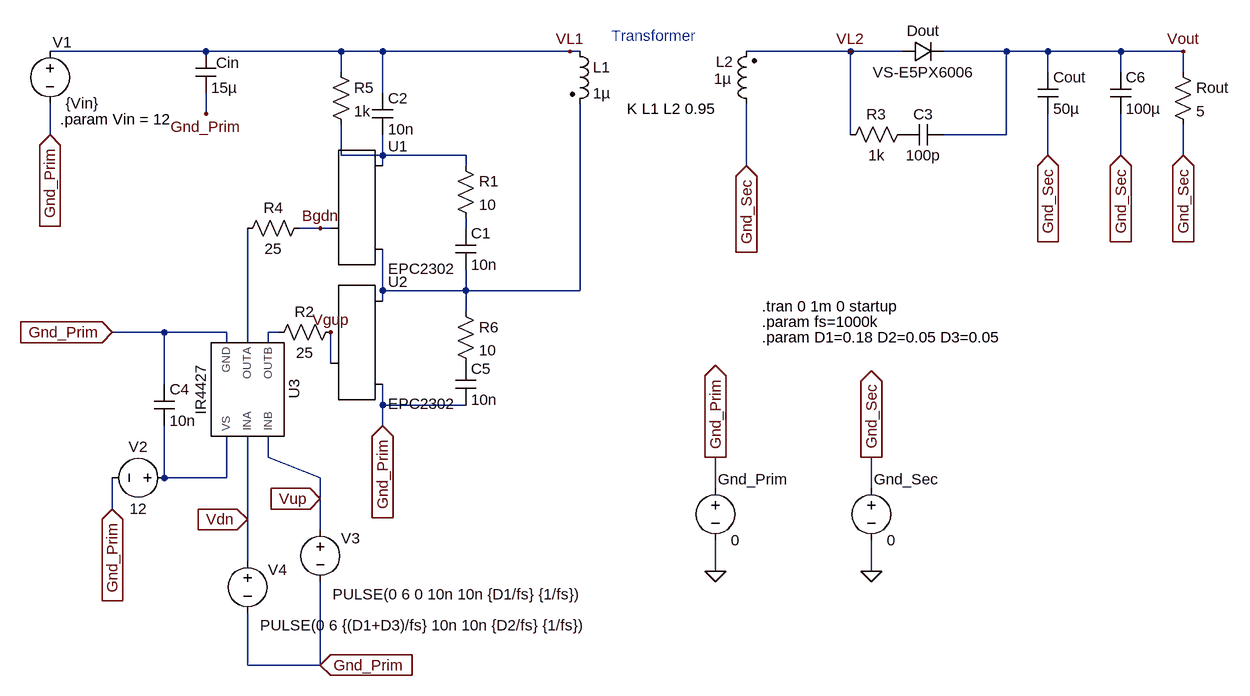
[diagram p0: schematic Flyback V6.asc]
Flyback V6.asc, the LTspice schematic file:
Version 4
SHEET 1 1088 816
WIRE -496 -288 -736 -288
WIRE -288 -288 -496 -288
WIRE -224 -288 -288 -288
WIRE 64 -288 -224 -288
WIRE 80 -288 64 -288
WIRE 496 -288 336 -288
WIRE 576 -288 496 -288
WIRE 736 -288 640 -288
WIRE 800 -288 736 -288
WIRE 912 -288 800 -288
WIRE 1008 -288 912 -288
WIRE -288 -256 -288 -288
WIRE 800 -256 800 -288
WIRE 912 -256 912 -288
WIRE 1008 -256 1008 -288
WIRE -224 -224 -224 -288
WIRE -496 -192 -496 -224
WIRE -736 -160 -736 -208
WIRE 496 -160 496 -288
WIRE 736 -160 736 -288
WIRE 736 -160 640 -160
WIRE -288 -128 -288 -176
WIRE -224 -128 -224 -160
WIRE -224 -128 -288 -128
WIRE -96 -128 -224 -128
WIRE 800 -128 800 -192
WIRE 912 -128 912 -192
WIRE 1008 -128 1008 -176
WIRE -224 -112 -224 -128
WIRE -96 -112 -96 -128
WIRE 336 -112 336 -208
WIRE -320 -16 -352 -16
WIRE -304 -16 -320 -16
WIRE -96 -16 -96 -32
WIRE -224 80 -224 16
WIRE -96 80 -96 48
WIRE -96 80 -224 80
WIRE 80 80 80 -208
WIRE 80 80 -96 80
WIRE -224 96 -224 80
WIRE -96 112 -96 80
WIRE -560 144 -640 144
WIRE -464 144 -560 144
WIRE -384 144 -400 144
WIRE -464 160 -464 144
WIRE -432 160 -432 -16
WIRE -400 160 -400 144
WIRE -304 192 -304 144
WIRE -560 224 -560 144
WIRE -224 256 -224 224
WIRE -96 256 -224 256
WIRE -224 288 -224 256
WIRE -400 336 -400 304
WIRE -560 368 -560 288
WIRE -464 368 -464 304
WIRE -464 368 -560 368
WIRE -320 368 -400 336
WIRE 288 384 288 336
WIRE 528 384 528 336
WIRE -320 400 -320 368
WIRE -640 416 -640 368
WIRE -432 432 -432 304
WIRE -320 448 -320 400
WIRE -432 496 -432 432
WIRE 288 512 288 464
WIRE 528 512 528 464
WIRE -432 656 -432 576
WIRE -320 656 -320 528
WIRE -320 656 -432 656
FLAG 1008 -288 Vout
FLAG 64 -288 VL1
FLAG 496 -288 VL2
FLAG -432 432 Vdn
IOPIN -432 432 In
FLAG -320 400 Vup
IOPIN -320 400 In
FLAG -304 144 Vgup
FLAG -320 -16 Bgdn
FLAG 288 512 0
FLAG 288 336 Gnd_Prim
IOPIN 288 336 Out
FLAG 528 512 0
FLAG 528 336 Gnd_Sec
IOPIN 528 336 Out
FLAG -224 288 Gnd_Prim
IOPIN -224 288 In
FLAG -320 656 Gnd_Prim
IOPIN -320 656 In
FLAG -640 416 Gnd_Prim
IOPIN -640 416 In
FLAG -736 -160 Gnd_Prim
IOPIN -736 -160 In
FLAG -496 -192 Gnd_Prim
FLAG 336 -112 Gnd_Sec
IOPIN 336 -112 In
FLAG 800 -128 Gnd_Sec
IOPIN 800 -128 In
FLAG 912 -128 Gnd_Sec
IOPIN 912 -128 In
FLAG 1008 -128 Gnd_Sec
IOPIN 1008 -128 In
FLAG -640 144 Gnd_Prim
IOPIN -640 144 In
SYMBOL ind2 64 -304 R0
SYMATTR InstName L1
SYMATTR Value 1µ
SYMBOL ind2 352 -192 R180
WINDOW 0 36 80 Left 2
WINDOW 3 39 54 Left 2
SYMATTR InstName L2
SYMATTR Value 1µ
SYMBOL voltage -736 -304 R0
WINDOW 123 0 0 Left 0
WINDOW 39 24 44 Left 2
WINDOW 0 4 2 Left 2
SYMATTR InstName V1
SYMATTR Value {Vin}
SYMBOL diode 576 -272 R270
WINDOW 0 32 32 VTop 2
WINDOW 3 0 32 VBottom 2
SYMATTR InstName Dout
SYMATTR Value VS-E5PX6006
SYMBOL res 992 -272 R0
SYMATTR InstName Rout
SYMATTR Value 5
SYMBOL voltage -544 368 R90
WINDOW 0 -32 56 VBottom 2
WINDOW 3 32 56 VTop 2
WINDOW 123 0 0 Left 0
WINDOW 39 0 0 Left 0
SYMATTR InstName V2
SYMATTR Value 12
SYMBOL voltage -320 432 R0
WINDOW 123 0 0 Left 0
WINDOW 39 0 0 Left 0
WINDOW 3 19 115 Left 2
WINDOW 0 32 29 Left 2
SYMATTR Value PULSE(0 6 0 10n 10n {D1/fs} {1/fs})
SYMATTR InstName V3
SYMBOL IR4427 -432 224 R90
SYMATTR InstName U3
SYMBOL cap 784 -256 R0
SYMATTR InstName Cout
SYMATTR Value 50µ
SYMBOL cap -512 -288 R0
WINDOW 0 32 17 Left 2
SYMATTR InstName Cin
SYMATTR Value 15µ
SYMBOL EPCGaN -304 192 R0
SYMATTR InstName U2
SYMATTR Value EPC2302
SYMBOL res -112 -128 R0
SYMATTR InstName R1
SYMATTR Value 10
SYMBOL cap -112 -16 R0
SYMATTR InstName C1
SYMATTR Value 10n
SYMBOL res 592 -176 R90
WINDOW 0 0 56 VBottom 2
WINDOW 3 32 56 VTop 2
SYMATTR InstName R3
SYMATTR Value 1k
SYMBOL cap 640 -176 R90
WINDOW 0 0 32 VBottom 2
WINDOW 3 32 32 VTop 2
SYMATTR InstName C3
SYMATTR Value 100p
SYMBOL cap -576 224 R0
SYMATTR InstName C4
SYMATTR Value 10n
SYMBOL voltage -432 480 R0
WINDOW 123 0 0 Left 0
WINDOW 39 0 0 Left 0
WINDOW 3 19 115 Left 2
WINDOW 0 32 29 Left 2
SYMATTR Value PULSE(0 6 {(D1+D3)/fs} 10n 10n {D2/fs} {1/fs})
SYMATTR InstName V4
SYMBOL EPCGaN -304 -16 R0
SYMATTR InstName U1
SYMATTR Value EPC2302
SYMBOL res -288 128 R90
WINDOW 0 0 56 VBottom 2
WINDOW 3 32 56 VTop 2
SYMATTR InstName R2
SYMATTR Value 25
SYMBOL res -336 -32 R90
WINDOW 0 0 56 VBottom 2
WINDOW 3 32 56 VTop 2
SYMATTR InstName R4
SYMATTR Value 25
SYMBOL cap -240 -224 R0
SYMATTR InstName C2
SYMATTR Value 10n
SYMBOL res -304 -272 R0
SYMATTR InstName R5
SYMATTR Value 1k
SYMBOL res -112 96 R0
SYMATTR InstName R6
SYMATTR Value 10
SYMBOL cap -112 192 R0
SYMATTR InstName C5
SYMATTR Value 10n
SYMBOL cap 896 -256 R0
SYMATTR InstName C6
SYMATTR Value 100µ
SYMBOL voltage 288 368 R0
WINDOW 123 0 0 Left 0
WINDOW 39 24 44 Left 2
WINDOW 0 4 2 Left 2
SYMATTR InstName Gnd_Prim
SYMATTR Value 0
SYMBOL voltage 528 368 R0
WINDOW 123 0 0 Left 0
WINDOW 39 24 44 Left 2
WINDOW 0 4 2 Left 2
SYMATTR InstName Gnd_Sec
SYMATTR Value 0
TEXT 152 -200 Left 2 !K L1 L2 0.95
TEXT -720 -184 Left 2 !.param Vin = 12
TEXT 360 104 Left 2 !.tran 0 1m 0 startup
TEXT 360 128 Left 2 !.param fs=1000k
TEXT 360 152 Left 2 !.param D1=0.18 D2=0.05 D3=0.05
TEXT 128 -312 Left 2 ;Transformer

The netlist it stands for:
* Flyback V6.asc
L1 VL1 N003 1µ
L2 Gnd_Sec VL2 1µ
V1 VL1 Gnd_Prim {Vin}
Dout VL2 Vout VS-E5PX6006
Rout Vout Gnd_Sec 5
V2 N006 Gnd_Prim 12
V3 Vup Gnd_Prim PULSE(0 6 0 10n 10n {D1/fs} {1/fs})
XU3 N004 N005 Gnd_Prim Vup Vdn N006 IR4427  ; pins OUTB OUTA GND INB INA VS
Cout Vout Gnd_Sec 50µ
Cin VL1 Gnd_Prim 15µ
XU2 Vgup N003 Gnd_Prim EPC2302
R1 N001 N002 10
C1 N002 N003 10n
R3 P001 VL2 1k
C3 Vout P001 100p
C4 Gnd_Prim N006 10n
V4 Vdn Gnd_Prim PULSE(0 6 {(D1+D3)/fs} 10n 10n {D2/fs} {1/fs})
XU1 Bgdn N001 N003 EPC2302
R2 Vgup N004 25
R4 Bgdn N005 25
C2 VL1 N001 10n
R5 VL1 N001 1k
R6 N003 P002 10
C5 P002 Gnd_Prim 10n
C6 Vout Gnd_Sec 100µ
V§Gnd_Prim Gnd_Prim 0 0
V§Gnd_Sec Gnd_Sec 0 0
.model D D
.lib standard.dio
K L1 L2 0.95
.param Vin = 12
.tran 0 1m 0 startup
.param fs=1000k
.param D1=0.18 D2=0.05 D3=0.05
* Transformer
.lib D:\Users\C1\Documents\C1_Repos\Technion_Project_A\LTSPICE\Components\Libraries\IR4427.lib
.backanno
.end